# Altium project MB1136.PrjPCB
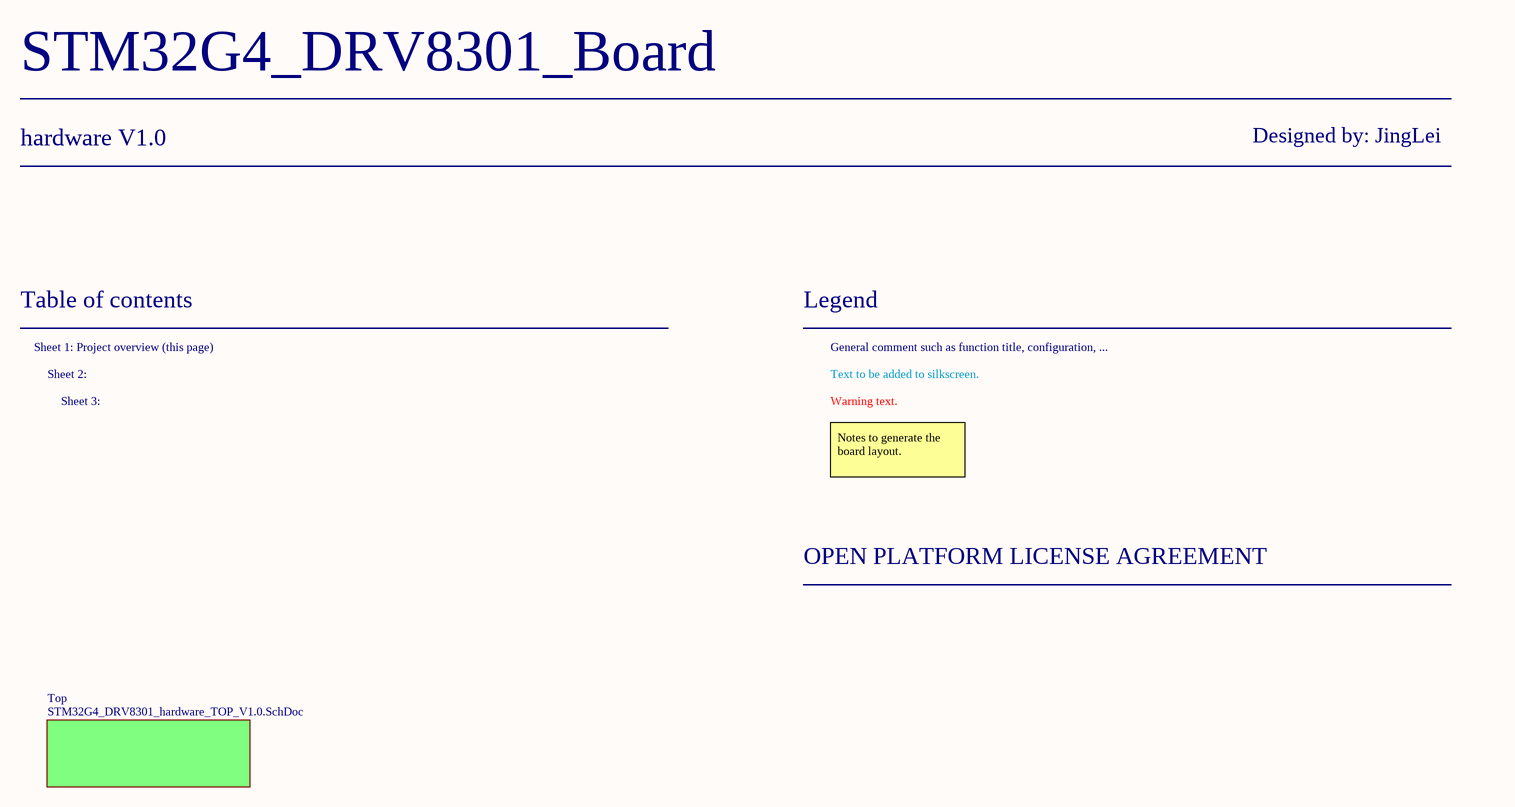
[diagram p0: Project_Overview.SchDoc]
Board_Assembly_revision: 05; Board_Document_Date: 17-AUG-2022; Board_name: NUCLEO-XXXXRX; Board_PCB_revision: C; Board_Reference: MB1136
2 sheets, 17 parts. Net scope: hierarchical (ports join the sheet entries above them; power ports are global).
Board file: MB1136.PcbDoc
Sheets:
  Project_Overview.SchDoc
  Top.SchDoc

## Sheet Project_Overview.SchDoc
size 420 x 297 mm; SheetNumber: 1; SheetTotal: 8

### Sub-sheets
Top = STM32G4_DRV8301_hardware_TOP_V1.0.SchDoc (file not in this document): no entries

### Notes on the sheet
- STM32G4_DRV8301_Board
- hardware V1.0
- Designed by: JingLei
- Table of contents
- Sheet 1: Project overview (this page)
- Legend
- General comment such as function title, configuration, ...
- Sheet 2:
- Sheet 3:
- Text to be added to silkscreen.
- Warning text.
- Notes to generate the board layout.
- OPEN PLATFORM LICENSE AGREEMENT
- THIS DOCUMENT AND THE DATA DISCLOSED HEREIN OR
- HEREWITH IS THE PROPERTY OF ALTIUM LIMITED AND MAY
- DWG NO:
- REVISION
- REV:
- DESCRIPTION
- DATE
- APPROVED
- BE FREELY DISTRIBUTED IN WHOLE. NO RIGHTS ARE
- RESERVED OR EXPRESS OR IMPLIED WARANTEE GIVEN.
- ENG:
- APPROVALS
- PROJECT
- DSN:
- CHK:
- REFERENCE DOCUMENTS
- PROJECT REVISION:
- TITLE
- DOCUMENT REVISION:
- DESIGN ITEM:
- BOM:
- FAB DWG:
- PCB DWG:
- ASSY DWG:
- SCALE:
- A3
- SIZE
- CAGE CODE
- FILE NAME
- DWG NO.
- SHEET
- OF
- REV

## Sheet Top.SchDoc: TOP & POWER
size A4; DocumentNumber: MB1136; Revision: C.3; SheetNumber: 2; SheetTotal: 5; Project: NUCLEO-XXXXRX
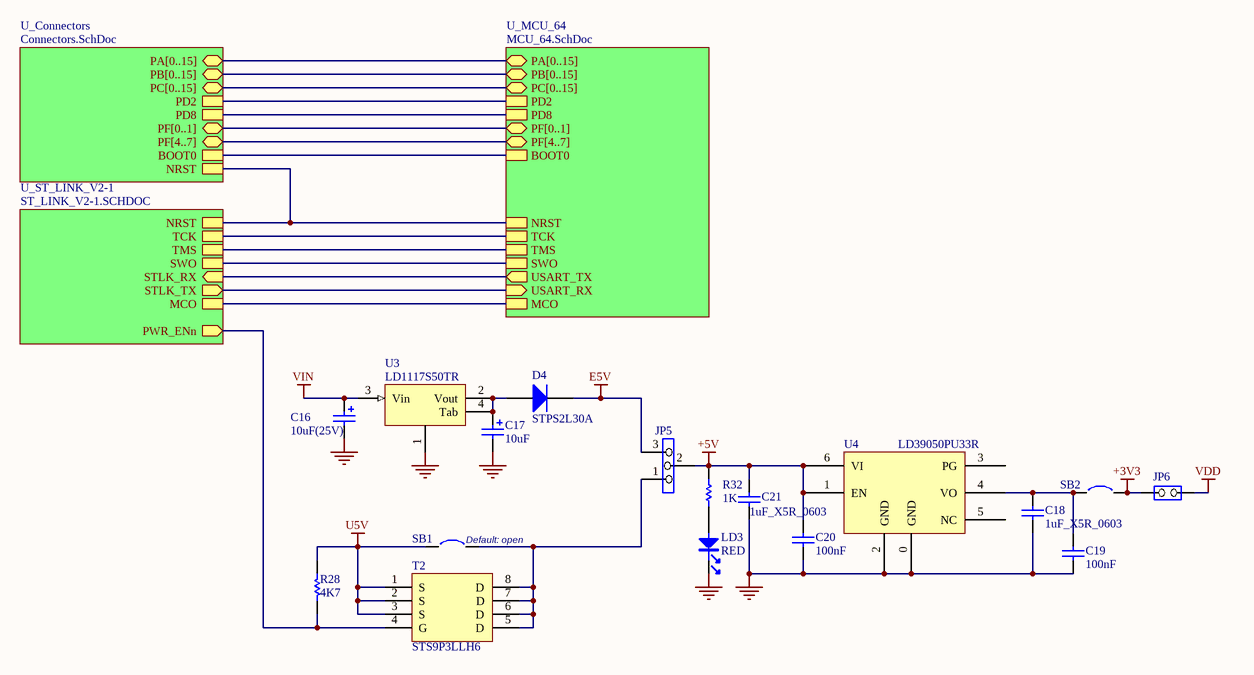
[diagram p1: Top.SchDoc]

### Parts
C16  10uF(25V)  [TAN-B]
C17  10uF  [TAN-A]
C18  1uF_X5R_0603  [0603C]
C19  100nF  [0603C]
C20  100nF  [0603C]
C21  1uF_X5R_0603  [0603C]
D4  STPS2L30A  [SMA]
JP5  (no value)  [SIP3]
JP6  (no value)  [SIP2/2.54]
LD3  RED  [0603D]
R28  4K7  [0603R]
R32  1K  [0603R]
SB1  Circuit Breaker  [JP2_SMD]  (value not drawn)
SB2  Circuit Breaker  [JP2_SMD]  (value not drawn)
T2  value STS9P3LLH6  [ICC_SO8_5X4_P127]  (hidden comment: TRANS_P-CHANNEL_STS9P3LLH6)
U3  LD1117S50TR  [SOT-223]
U4  LD39050PU33R  [DFN6(3X3)]

### Sub-sheets
U_Connectors = Connectors.SchDoc (file not in this document): PA[0..15] (bidir), PB[0..15] (bidir), PC[0..15] (bidir), PF[4..7] (bidir), PD2, PD8, PF[0..1] (bidir), NRST, BOOT0
U_MCU_64 = MCU_64.SchDoc (file not in this document): NRST, MCO, USART_RX (in), USART_TX (out), PA[0..15] (bidir), PB[0..15] (bidir), PC[0..15] (bidir), PF[4..7] (bidir), PD2, TCK, TMS, SWO, PD8, PF[0..1] (bidir), BOOT0
U_ST_LINK_V2-1 = ST_LINK_V2-1.SCHDOC (file not in this document): TMS, TCK, MCO, NRST, STLK_RX (in), STLK_TX (out), SWO, PWR_ENn (out)

### Nets
+3V3: JP6.1(COMMON) SB2.2
+5V: C20.2 C21.1 JP5.2 R32.2 U4.1(EN) U4.6(VI)
E5V: D4.2(K) JP5.3
GND: C16.2 C17.2 C18.2 C19.1 C20.1 C21.2 LD3.2 U3.1 U4.0(GND) U4.2(GND)
U5V: R28.1 SB1.1 T2.1(S) T2.2(S) T2.3(S)
VDD: JP6.2(NO)
VIN: C16.1 U3.3(Vin)
NetC17_1: C17.1 D4.1(A) U3.2(Vout) U3.4(Tab)
NetC18_1: C18.1 C19.2 SB2.1 U4.4(VO)
NetJP5_1: JP5.1 SB1.2 T2.5(D) T2.6(D) T2.7(D) T2.8(D)
NetLD3_1: LD3.1 R32.1
NetR28_2: R28.2 T2.4(G) ; sheet U_ST_LINK_V2-1/PWR_ENn
(unnamed): sheet U_ST_LINK_V2-1/TMS, sheet U_MCU_64/TMS
(unnamed): sheet U_ST_LINK_V2-1/TCK, sheet U_MCU_64/TCK
(unnamed): sheet U_ST_LINK_V2-1/MCO, sheet U_MCU_64/MCO
(unnamed): sheet U_ST_LINK_V2-1/NRST, sheet U_Connectors/NRST, sheet U_MCU_64/NRST
(unnamed): sheet U_ST_LINK_V2-1/STLK_RX, sheet U_MCU_64/USART_TX
(unnamed): sheet U_ST_LINK_V2-1/STLK_TX, sheet U_MCU_64/USART_RX
(unnamed): sheet U_ST_LINK_V2-1/SWO, sheet U_MCU_64/SWO
(unnamed): sheet U_Connectors/PD2, sheet U_MCU_64/PD2
(unnamed): sheet U_Connectors/PD8, sheet U_MCU_64/PD8
(unnamed): sheet U_Connectors/BOOT0, sheet U_MCU_64/BOOT0

Not connected (* = marked no-connect by the designer): U4 3(PG) 5(NC)

### Buses and harness runs
bus sheet U_Connectors/PA[0..15] = sheet U_MCU_64/PA[0..15]
bus sheet U_Connectors/PB[0..15] = sheet U_MCU_64/PB[0..15]
bus sheet U_Connectors/PC[0..15] = sheet U_MCU_64/PC[0..15]
bus sheet U_Connectors/PF[0..1] = sheet U_MCU_64/PF[0..1]
bus sheet U_Connectors/PF[4..7] = sheet U_MCU_64/PF[4..7]

### Notes on the sheet
- (near SB1) Default: open
- Title:
- Project:
- Size:
- Revision:
- Variant:
- A4
- -
- Date:
- Reference:
- Sheet:
- of

### Library data of the parts
C16 C17 = Cap Pol1: Polarized Capacitor (Radial); Published: 8-Jun-2000; Revision: July-2002: Re-released for DXP Platform.; Publisher: Altium Limited; Value: 10uF
C18 C21 = CAP SMD 0603  X5R 1µF 25V 10%: 0603  X5R 1µF; Rated voltage: 25V; Tolerance: 10%; Manufacturer: *; Manufacturer P/N: *; Order code Farnell: 1288202RL; Value: 1µF; Power: *; Technology: X5R; Temperature  Factor: *; Temperature Max: +125°C; Temperature Min: -55°C; STS Code: *
C19 C20 = Capacitor_ST: Capacitor 0402 / 0603 / 0805; Revision: July-2002: Re-released for DXP Platform.; Value: 100nF
D4 = STPS2L30A: Manuf_1: STM; Provided: ST; Order: BAT60JFILM; ECCN_US/EU: EAR99/NEC; Revision: July-2002: Re-released for DXP Platform.; Manuf_Part_1: BAT60JFILM; Distrib: ST
JP5 = Jumper3
JP6 = JP2
LD3 = PHOTO
R28 = Res1: Resistor; Value: 1K; Published: 8-Jun-2000; Revision: July-2002: Re-released for DXP Platform.; Publisher: Altium Limited
R32 = Resistor_ST: Resistor 0402 / 0603 / 0805; Value: 10K
SB1 SB2 = Circuit Breaker: Solder: NO; Published: 24-Mar-1999; Revision: July-2002: Re-released for DXP Platform.; Publisher: Altium Limited
T2 = MCD-02507: Transistor, MOSFET, P-CH, -30V, -9A, SO-8; Part_Preference: Recommended; Manufacturer: STMICROELECTRONICS; Component_Country_Of_Origin: China; ShowFields: YES; ID: 4613; Internal_Part_Number: MCD-02507; Status: Released; Part_Type: Transistor; Manufacturer_Part_Number: STS9P3LLH6; Package: SO-8; ComponentLink1URL: http://tunmcdsvn.tun.st.com/Component_Documentation_Library/Trunk/Transistor/STMICROELECTRONICS_STS9P3LLH6/; Order_Code_Digikey: STS9P3LLH6-ND; Order_Code_Farnell: 2807224; Order_Code_RS: N/A
U3 = LD1117
U4 = LD39050P